# EAGLE design driver (EAGLE 9.6.2)
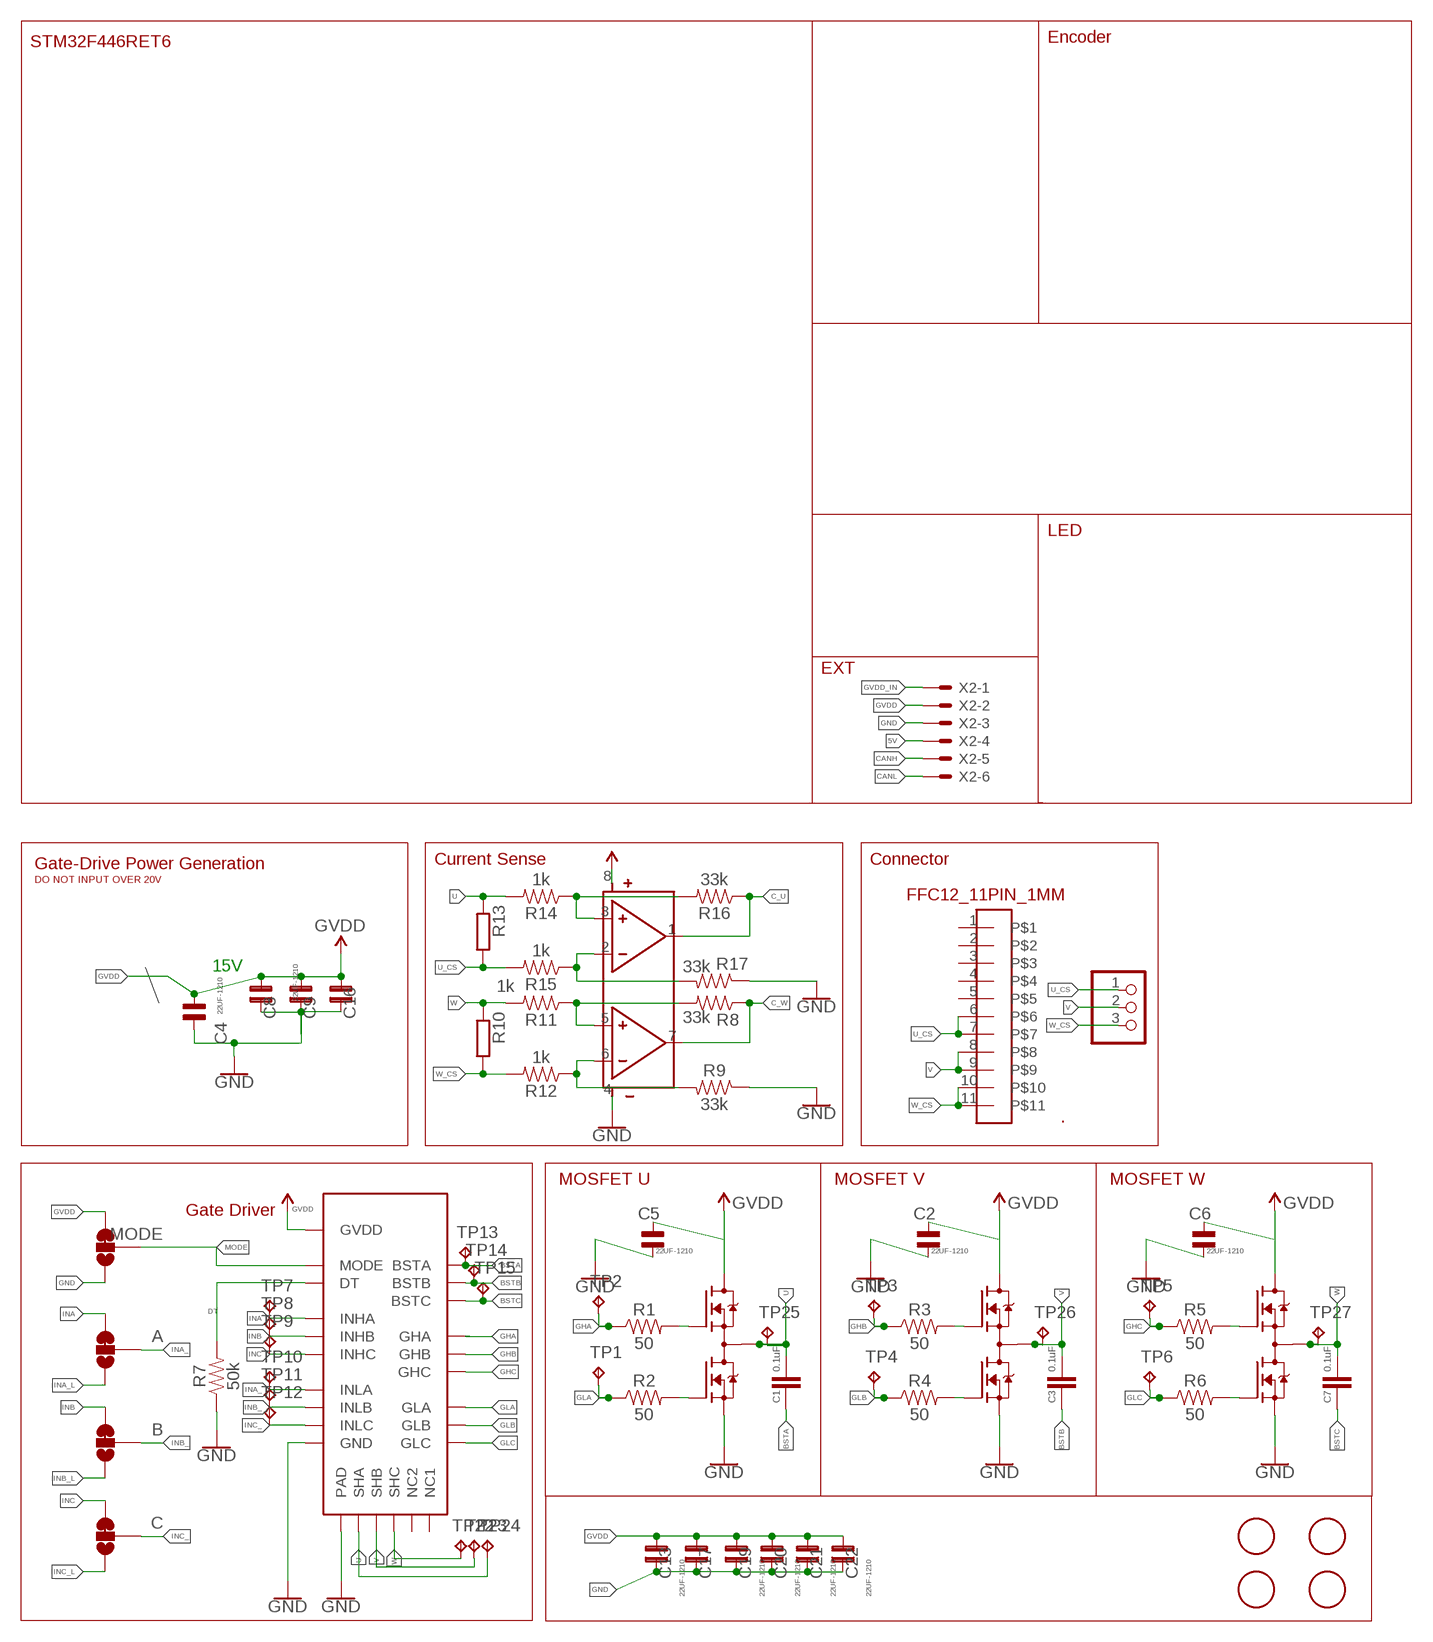
[diagram p0: schematic, sheet 1]

## Parts
.  FFC12_11PIN_1MM  [CON-SMT-FFCFPC_52207-1185]
A  JUMPER-SMT_3_1-NC_TRACE_SILK  [SMT-JUMPER_3_1-NC_TRACE_SILK]
B  JUMPER-SMT_3_1-NC_TRACE_SILK  [SMT-JUMPER_3_1-NC_TRACE_SILK]
C  JUMPER-SMT_3_1-NC_TRACE_SILK  [SMT-JUMPER_3_1-NC_TRACE_SILK]
C1  0.1uF  0.1UF-0603-25V-5%  [0603]
C2  22UF-1210  C0805  [0805]
C3  0.1uF  0.1UF-0603-25V-5%  [0603]
C4  0.1uF  C0805  [0805]
C5  22UF-1210  C0805  [0805]
C6  22UF-1210  C0805  [0805]
C7  0.1uF  0.1UF-0603-25V-5%  [0603]
C8  22UF-1210  C0805  [0805]
C9  22UF-1210  C0805  [0805]
C13  22UF-1210  C0805  [0805]
C16  22UF-1210  C0805  [0805]
C17  22UF-1210  C0805  [0805]
C19  22UF-1210  C0805  [0805]
C20  22UF-1210  C0805  [0805]
C21  22UF-1210  C0805  [0805]
C22  22UF-1210  C0805  [0805]
JP3  PINHD-1X3CB  [1X03-CLEANBIG]
MODE  JUMPER-SMT_3_1-NC_TRACE_SILK  [SMT-JUMPER_3_1-NC_TRACE_SILK]
Q2  SIZ240DT-T1-GE3  [TRANS_SIZ240DT-T1-GE3]
Q3  SIZ240DT-T1-GE3  [TRANS_SIZ240DT-T1-GE3]
Q4  SIZ240DT-T1-GE3  [TRANS_SIZ240DT-T1-GE3]
R1  50  1KOHM-0603-1/10W-1%  [0603]
R2  50  1KOHM-0603-1/10W-1%  [0603]
R3  50  1KOHM-0603-1/10W-1%  [0603]
R4  50  1KOHM-0603-1/10W-1%  [0603]
R5  50  1KOHM-0603-1/10W-1%  [0603]
R6  50  1KOHM-0603-1/10W-1%  [0603]
R7  50k  1KOHM-0603-1/10W-1%  [0603]
R8  33k  1KOHM-0603-1/10W-1%  [0603]
R9  33k  1KOHM-0603-1/10W-1%  [0603]
R10  SMS-REF  [SMS-REF]
R11  1k  1KOHM-0603-1/10W-1%  [0603]
R12  1k  1KOHM-0603-1/10W-1%  [0603]
R13  SMS-REF  [SMS-REF]
R14  1k  1KOHM-0603-1/10W-1%  [0603]
R15  1k  1KOHM-0603-1/10W-1%  [0603]
R16  33k  1KOHM-0603-1/10W-1%  [0603]
R17  33k  1KOHM-0603-1/10W-1%  [0603]
TP1  TPPAD1-13  [P1-13]
TP2  TPPAD1-13  [P1-13]
TP3  TPPAD1-13  [P1-13]
TP4  TPPAD1-13  [P1-13]
TP5  TPPAD1-13  [P1-13]
TP6  TPPAD1-13  [P1-13]
TP7  TPPAD1-13  [P1-13]
TP8  TPPAD1-13  [P1-13]
TP9  TPPAD1-13  [P1-13]
TP10  TPPAD1-13  [P1-13]
TP11  TPPAD1-13  [P1-13]
TP12  TPPAD1-13  [P1-13]
TP13  TPPAD1-13  [P1-13]
TP14  TPPAD1-13  [P1-13]
TP15  TPPAD1-13  [P1-13]
TP22  TPPAD1-13  [P1-13]
TP23  TPPAD1-13  [P1-13]
TP24  TPPAD1-13  [P1-13]
TP25  TPPAD1-13  [P1-13]
TP26  TPPAD1-13  [P1-13]
TP27  TPPAD1-13  [P1-13]
U1  QFN50P400X400X100-25NDRV8300DRGER  [QFN50P400X400X100-25N]
U4  SOP80P620X125-8N  [SOP80P620X125-8N]
U$1  PIN  [3MM]
U$3  PIN  [3MM]
U$4  PIN  [3MM]
U$5  PIN  [3MM]
X2  JST-XH-06-PIN-LONG-PAD  [JST-XH-06-PACKAGE-LONG-PAD]

## Nets
3V3: U4.8(VDD) ; supply symbol labelled GVDD
5V: X2.4
BSTA: C1.1 TP13.TP U1.BSTA
BSTB: C3.1 TP14.TP U1.BSTB
BSTC: C7.1 TP15.TP U1.BSTC
C_U: R16.1 U4.1(O1)
C_W: R8.1 U4.7(O2)
CANH: X2.5
CANL: X2.6
DT: R7.2 U1.DT
GHA: R1.1 TP2.TP U1.GHA
GHB: R3.1 TP3.TP U1.GHB
GHC: R5.1 TP5.TP U1.GHC
GLA: R2.1 TP1.TP U1.GLA
GLB: R4.1 TP4.TP U1.GLB
GLC: R6.1 TP6.TP U1.GLC
GND: C2.1 C4.2 C5.1 C6.1 C8.1 C9.1 C13.1 C16.1 C17.1 C19.1 C20.1 C21.1 C22.1 MODE.1 Q2.5(S2) Q2.6(S2) Q2.7(S2) Q3.5(S2) Q3.6(S2) Q3.7(S2) Q4.5(S2) Q4.6(S2) Q4.7(S2) R7.1 R9.1 R17.1 U1.GND U1.PAD U4.4(GND) X2.3
GVDD: C2.2 C4.1 C5.2 C6.2 C8.2 C9.2 C13.2 C16.2 C17.2 C19.2 C20.2 C21.2 C22.2 MODE.3 Q2.2(D1) Q2.3(D1) Q2.4(D1) Q2.10(D1) Q3.2(D1) Q3.3(D1) Q3.4(D1) Q3.10(D1) Q4.2(D1) Q4.3(D1) Q4.4(D1) Q4.10(D1) U1.GVDD X2.2 ; supply symbol labelled PVDD
GVDD_IN: X2.1
HA: Q2.1(G1) R1.2
HB: Q3.1(G1) R3.2
HC: Q4.1(G1) R5.2
INA: A.3 TP7.TP U1.INHA
INA_: A.2 TP10.TP U1.INLA
INA_L: A.1
INB: B.3 TP8.TP U1.INHB
INB_: B.2 TP11.TP U1.INLB
INB_L: B.1
INC: C.3 TP9.TP U1.INHC
INC_: C.2 TP12.TP U1.INLC
INC_L: C.1
LA: Q2.8(G2) R2.2
LB: Q3.8(G2) R4.2
LC: Q4.8(G2) R6.2
MODE: MODE.2 U1.MODE
N$8: R8.2 R11.1 U4.5(P2)
N$9: R9.2 R12.1 U4.6(M2)
N$10: R14.1 R16.2 U4.3(P1)
N$11: R15.1 R17.2 U4.2(M1)
U: C1.2 Q2.9(S1/D2) R13.2 R14.2 TP24.TP TP25.TP U1.SHA
U_CS: ..6 ..7 JP3.1 R13.1 R15.2
V: ..8 ..9 C3.2 JP3.2 Q3.9(S1/D2) TP23.TP TP26.TP U1.SHB
W: C7.2 Q4.9(S1/D2) R10.2 R11.2 TP22.TP TP27.TP U1.SHC
W_CS: ..10 ..11 JP3.3 R10.1 R12.2
Unconnected: ..1 ..2 ..3 ..4 ..5 U1.NC1 U1.NC2 U$1.P$1 U$3.P$1 U$4.P$1 U$5.P$1

## Notes on the sheet
- STM32F446RET6 | Encoder
- LED
- Recommended
- EXT
- Gate-Drive Power Generation | Current Sense | Connector
- DO NOT INPUT OVER 20V
- 15V
- MOSFET U | MOSFET V | MOSFET W
- Gate Driver

## Library data of the parts
. = MotorDriver_FourthEdition_prot:FFC12_11PIN_1MM
A B C MODE = SparkFun-Jumpers:JUMPER-SMT_3_1-NC_TRACE: Normally closed trace jumper (1 of 2 connections) This jumper has a trace between two pads so it's normally closed (NC). The other connection is normally open (NO). Use a razor knife to open the connection. For best results follow the IPC guidelines for cutting traces: Cutout at least 0.063 mm (0.005 in). Remove all loose material to clean up the cut area. Seal the cut with an approved epoxy. Reapply solder to reclose the connection, or to close the NO connection.
C1 C3 C7 = SparkFun-Capacitors:0.1UF: 0.1µF ceramic capacitors A capacitor is a passive two-terminal electrical component used to store electrical energy temporarily in an electric field.; PROD_ID: CAP-08604
C2 C4-C6 C8 C9 C13 C16 C17 C19-C22 = capsmd:C0805
JP3 = adafruit:PINHD-1X3: PIN HEADER
Q2-Q4 = SIZ240DT-T1-GE3:SIZ240DT-T1-GE3: Check availability <https://pricing.snapeda.com/parts/SIZ240DT-T1-GE3/Vishay%20Siliconix/view-part?ref=eda>; AVAILABILITY: In Stock; DESCRIPTION: Mosfet Array 2 N-Channel (Dual) 40V 17.2A (Ta), 48A (Tc), 16.9A (Ta), 47A (Tc) 4.3W (Ta), 33W (Tc) Surface Mount 8-PowerPair® (3.3x3.3); MF: Vishay Siliconix; MP: SIZ240DT-T1-GE3; PACKAGE: PowerWDFN-8 Vishay Siliconix; PRICE: None; PURCHASE-URL: https://pricing.snapeda.com/search/part/SIZ240DT-T1-GE3/?ref=eda
R1-R9 R16 R17 = SparkFun-Resistors:1KOHM: 1kΩ resistor A resistor is a passive two-terminal electrical component that implements electrical resistance as a circuit element. Resistors act to reduce current flow, and, at the same time, act to lower voltage levels within circuits. - Wikipedia; PROD_ID: RES-07856; VALUE: 1k
R10 R13 = resistor-shunt:SMS-REF: SMD SHUNT RESISTOR; OC_FARNELL: unknown; OC_NEWARK: unknown
R11 R12 R14 R15 = SparkFun-Resistors:1KOHM: 1kΩ resistor A resistor is a passive two-terminal electrical component that implements electrical resistance as a circuit element. Resistors act to reduce current flow, and, at the same time, act to lower voltage levels within circuits. - Wikipedia; PROD_ID: RES-07856
TP1-TP15 TP22-TP27 = testpad:TP: Test pad
U1 = DRV8300DRGER:QFN50P400X400X100-25N: DRV8300
U4 = NJM2732:SOP80P620X125-8N; A1_MIN: 0.0; A_MAX: 1.25; A_MIN: 1.25; A_NOM: 1.25; B_MAX: 0.35; B_MIN: 0.35; B_NOM: 0.35; D2_MAX: 0.0; D_MAX: 3.5; D_MIN: 3.5; D_NOM: 3.5; E1_MAX: 4.2; E1_MIN: 4.2; E1_NOM: 4.2; E2_MAX: 0.0; ENOM: 0.8; E_MAX: 6.2; E_MIN: 6.2; E_NOM: 6.2; L_MAX: 0.5; L_MIN: 0.5; L_NOM: 0.5; MANUFACTURER: New Japan Radio; PIN_COUNT: 8.0; SNAPEDA_PACKAGE_ID: 11524; STANDARD: IPC 7351B
U$1 U$3-U$5 = pin:PIN
X2 = Rembrandt Electronics - JST XH Connectors v1-0:JST-XH-06-PIN: JST XH Connector 2 Pin Wire to board connector. Pitch: 2,54 mm, (0.100") Number of pins: 6 Created by Rembrandt Electronics www.rembrandtelectronics.com

## Net classes
0 default: width 0.3 mm

## Board
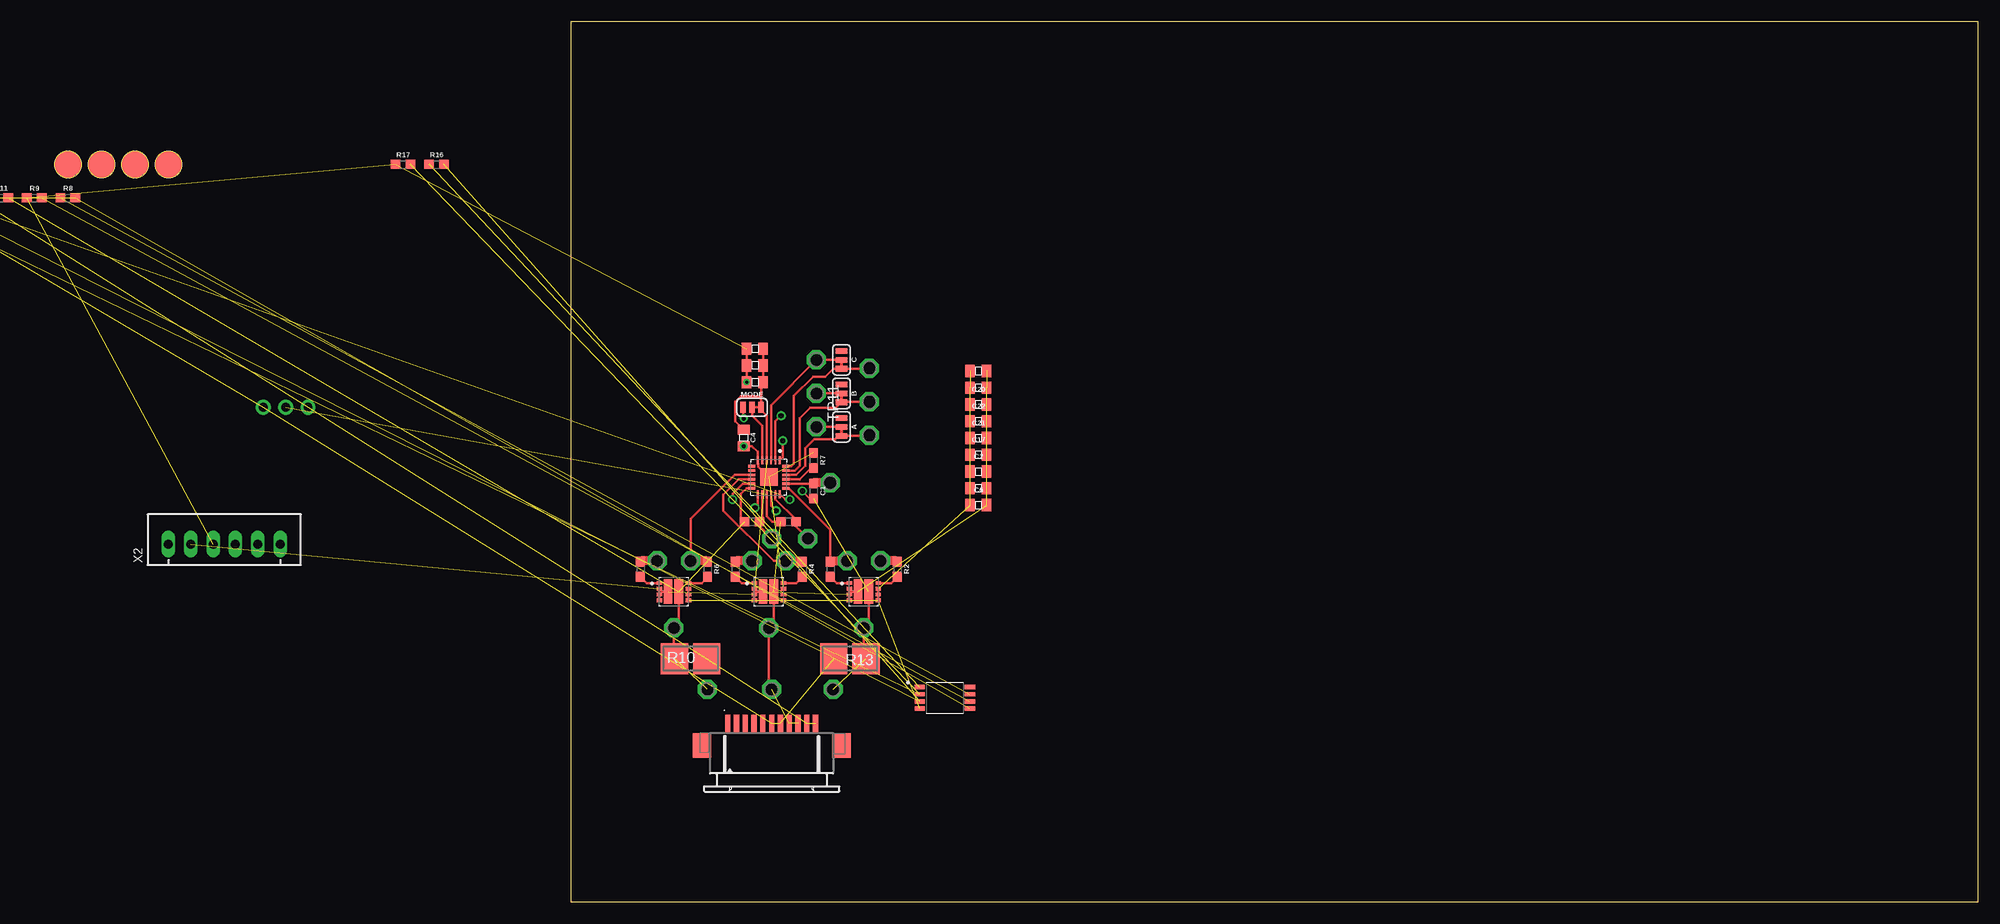
[diagram p1: board, top side]
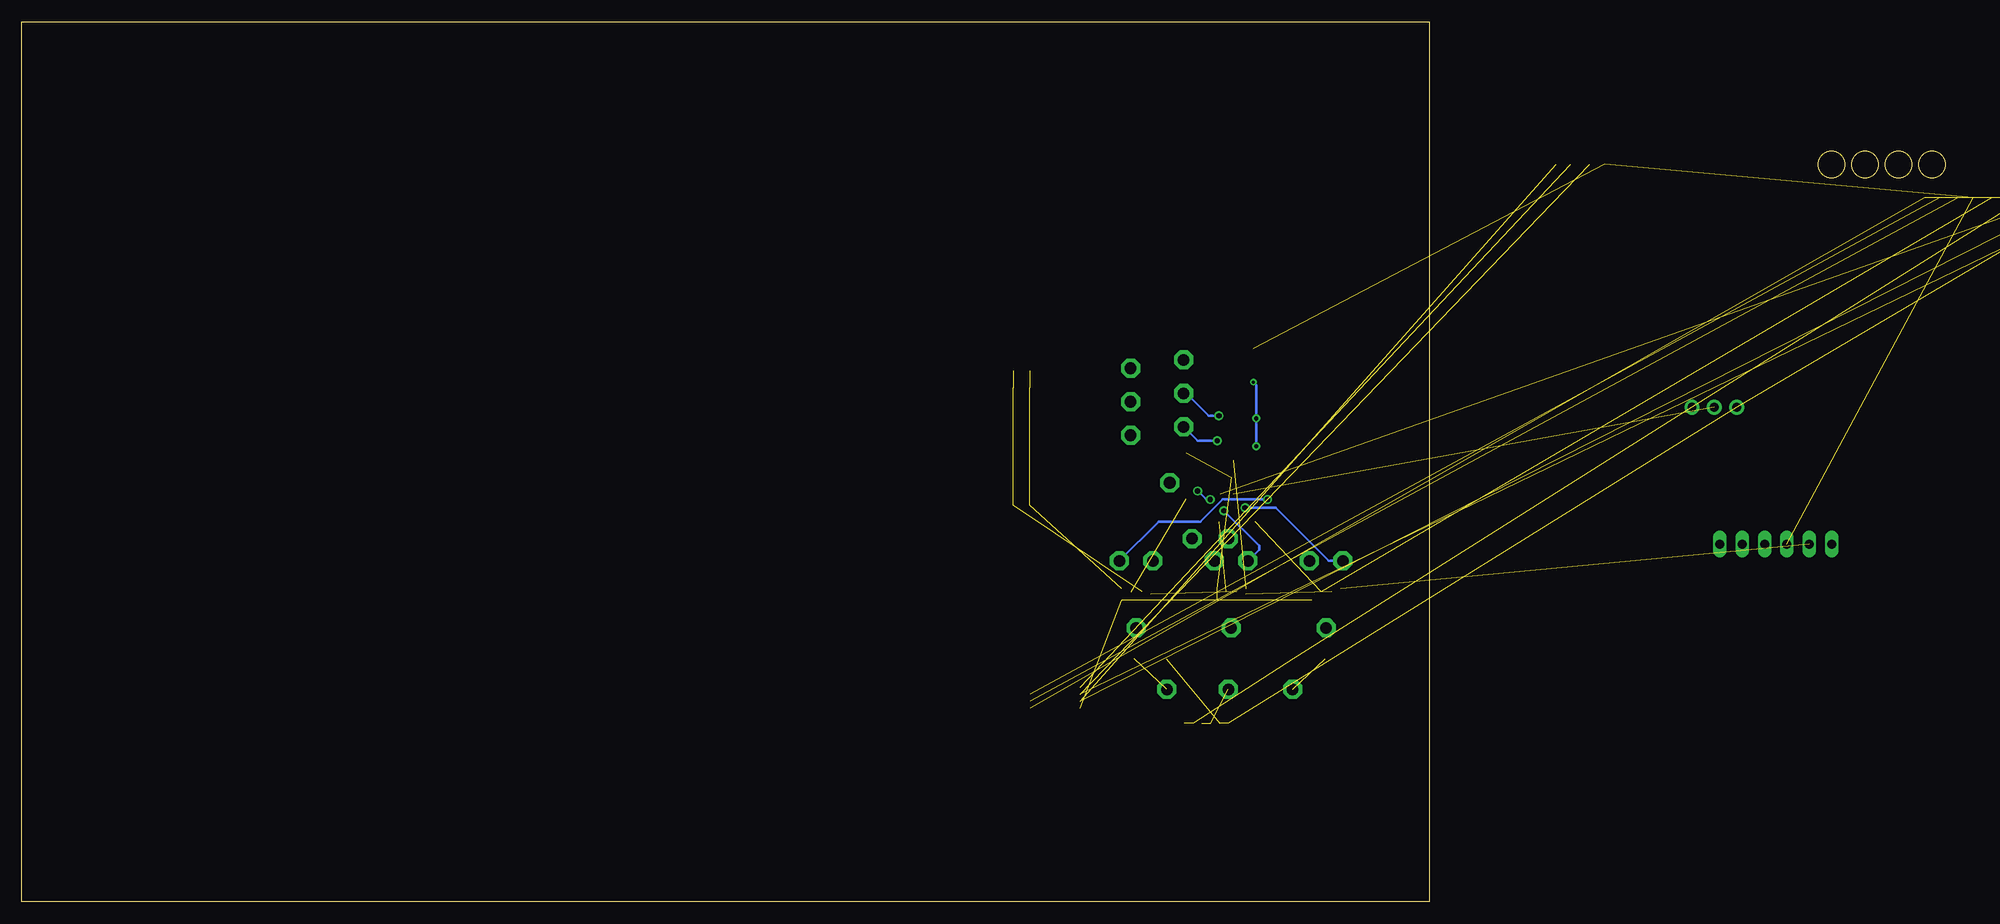
[diagram p2: board, bottom side, seen from below]

Size 160 x 100 mm. Coordinates in mm from the lower left corner, seen from the top.
Outline: 0,0 160,0 160,100 0,100 0,0
Copper layers (1*16): Top 0.035mm / dielectric 1.5mm / Bottom 0.035mm
Design rules "default": minimum track width 6mil, minimum drill 0.35mm, track to track 6mil, track to pad 6mil, pad to pad 6mil, via to via 6mil, smd to smd 6mil, copper to edge 40mil, drill to drill 6mil, minimum pad ring 10mil, minimum via ring 8mil, stop-mask expansion 4mil, vias tented up to drill 0mil, thermal gap 10mil

### Footprints (pad centres in the part's own frame; a part is rotated, then mirrored left to right if it is on the bottom)
CON-SMT-FFCFPC_52207-1185 = smd 0.6 x 1.9: 1 -5,2.5; 2 -4,2.5; 3 -3,2.5; 4 -2,2.5; 5 -1,2.5; 6 0,2.5; 7 1,2.5; 8 2,2.5; 9 3,2.5; 10 4,2.5; 11 5,2.5 | smd 2.1 x 2.8: P$1 -7.93,-0.03; P$4 7.945,-0.03
SMT-JUMPER_3_1-NC_TRACE_SILK = smd 0.635 x 1.27: 1 -1.016,0; 2 0,0; 3 1.016,0
0603 = smd 1.1 x 1: 1 -0.85,0; 2 0.85,0
0805 = smd 1.092 x 1.397: 1 -0.94,0; 2 0.94,0
1X03-CLEANBIG = drill 1.016 pad 1.676: 1 -2.54,0; 2 0,0; 3 2.54,0
TRANS_SIZ240DT-T1-GE3 = smd 0.62 x 0.44: 1 -1.64,0.975; 2 -1.64,0.325; 3 -1.64,-0.325; 4 -1.64,-0.975; 5 1.64,-0.975; 6 1.64,-0.325; 7 1.64,0.325; 8 1.64,0.975 | smd 1.005 x 2.8: 9 0.557,0 | smd 0.935 x 2.8: 10 -0.662,0
SMS-REF = smd 3.1 x 3.5: 1 1.829,0; 2 -1.829,0
P1-13 = drill 1.321 pad 2.159 octagon: TP 0,0
QFN50P400X400X100-25N = smd 0.27 x 0.86: BSTA 0.75,1.935; DT 0.25,1.935; GHA 1.25,1.935; GLA 0.75,-1.935; GLB 0.25,-1.935; GLC -0.25,-1.935; INHA -0.25,1.935; INHB -0.75,1.935; INHC -1.25,1.935; NC1 -1.25,-1.935; NC2 -0.75,-1.935; SHC 1.25,-1.935 | smd 0.86 x 0.27: BSTB 1.935,0.75; BSTC 1.935,-0.75; GHB 1.935,0.25; GHC 1.935,-1.25; GND -1.935,-1.25; GVDD -1.935,-0.25; INLA -1.935,1.25; INLB -1.935,0.75; INLC -1.935,0.25; MODE -1.935,-0.75; SHA 1.935,1.25; SHB 1.935,-0.25 | smd 2 x 2: PAD 0,0
SOP80P620X125-8N = smd 1.31 x 0.52: 1 -2.85,1.2; 2 -2.85,0.4; 3 -2.85,-0.4; 4 -2.85,-1.2; 5 2.85,-1.2; 6 2.85,-0.4; 7 2.85,0.4; 8 2.85,1.2
3MM = smd 3 x 3: P$1 0,0
JST-XH-06-PACKAGE-LONG-PAD = drill 1.016 long: 1 -6.35,0; 2 -3.81,0; 3 -1.27,0; 4 1.27,0; 5 3.81,0; 6 6.35,0

### Placement (x,y rotation side)
.  22.86,17.78 0 top
A  30.8,53.98 270 top
B  30.8,57.78 270 top
C  30.8,61.59 270 top
C1  27.62,46.67 270 top
C2  46.35,48.9 0 top
C3  24.77,43.18 180 top
C4  19.68,52.7 270 top
C5  46.35,46.99 0 top
C6  46.35,45.09 0 top
C7  20.64,43.18 180 top
C8  20.95,60.96 0 top
C9  20.95,59.05 0 top
C13  46.35,60.33 0 top
C16  20.95,62.87 0 top
C17  46.35,50.8 0 top
C19  46.35,58.42 0 top
C20  46.35,56.52 0 top
C21  46.35,52.7 0 top
C22  46.35,54.61 0 top
JP3  -32.38,56.2 0 top  (outside the outline)
MODE  20.64,56.2 0 top
Q2  33.34,35.24 0 top
Q3  22.54,35.24 0 top
Q4  11.75,35.24 0 top
R1  29.53,37.78 270 top
R2  37.15,37.78 270 top
R3  18.73,37.78 270 top
R4  26.35,37.78 270 top
R5  7.94,37.78 270 top
R6  15.56,37.78 270 top
R7  27.62,50.16 270 top
R8  -57.15,80.01 0 top  (outside the outline)
R9  -60.96,80.01 0 top  (outside the outline)
R10  13.65,27.62 0 top
R11  -64.77,80.01 0 top  (outside the outline)
R12  -68.58,80.01 0 top  (outside the outline)
R13  31.75,27.62 180 top
R14  -72.39,80.01 0 top  (outside the outline)
R15  -76.2,80.01 0 top  (outside the outline)
R16  -15.24,83.82 0 top  (outside the outline)
R17  -19.05,83.82 0 top  (outside the outline)
TP1  35.24,38.73 0 top
TP2  31.43,38.73 0 top
TP3  20.64,38.73 0 top
TP4  24.45,38.73 0 top
TP5  9.84,38.73 0 top
TP6  13.65,38.73 0 top
TP7  33.97,53.02 270 top
TP8  33.97,56.83 270 top
TP9  33.97,60.64 270 top
TP10  27.94,53.98 270 top
TP11  27.94,57.78 270 top
TP12  27.94,61.59 270 top
TP13  29.53,47.62 270 top
TP14  26.99,41.27 270 top
TP15  22.86,41.27 270 top
TP22  15.56,24.13 0 top
TP23  22.86,24.13 0 top
TP24  29.84,24.13 0 top
TP25  33.34,31.11 0 top
TP26  22.54,31.11 0 top
TP27  11.75,31.11 0 top
U1  22.54,48.26 270 top
U4  42.55,23.18 0 top
U$1  -45.72,83.82 0 top  (outside the outline)
U$3  -49.53,83.82 0 top  (outside the outline)
U$4  -53.34,83.82 0 top  (outside the outline)
U$5  -57.15,83.82 0 top  (outside the outline)
X2  -39.37,40.64 0 top  (outside the outline)

### Tracks (layer width: path | path; a pad name or v marks a point on that pad's centre or on a via)
BSTA
  Top 0.3: C1.1 U1.BSTA
  Top 1: C1.1 27.73,47.62 TP13.TP
BSTB
  Top 0.3: U1.BSTB 23.29,45.77 25.61,43.45 C3.1 25.61,42.65 TP14.TP
BSTC
  Top 0.3: U1.BSTC 21.79,43.48 C7.1 21.49,42.65 TP15.TP
C_U  (1 unrouted)
C_W  (1 unrouted)
DT
  Top 0.3: U1.DT 26.05,48.01 27.36,49.31 R7.2
GHA
  Top 0.3: U1.GHA 24.8,47.01 29.53,42.28 R1.1
  Top 1: R1.1 29.63,38.73 TP2.TP
GHB  (via drill 0.6)
  Top 0.3: U1.GHB 22.79,45.02 v23.37,44.45
  Top 1: TP3.TP 18.84,38.73 R3.1
  Bottom 0.3: v23.37,44.45 19.37,40.45 19.37,40.01 TP3.TP
GHC  (via drill 0.6)
  Top 0.3: U1.GHC 21.29,44.79 21.27,44.77 v20.95,44.77
  Top 1: TP5.TP 8.04,38.73 R5.1
  Bottom 0.3: TP5.TP 11.43,38.73 17.46,44.77 v20.95,44.77
GLA  (via drill 0.6)
  Top 0.3: U1.GLA 19.57,47.51 18.41,46.35 v18.41,45.72
  Top 1: R2.1 37.05,38.73 TP1.TP
  Bottom 0.3: v18.41,45.72 23.5,45.72 26.04,43.18 30.8,43.18 TP1.TP
GLB
  Top 0.3: U1.GLB 19.11,48.01 17.34,46.24 17.34,44.47 23.07,38.73 TP4.TP
  Top 1: TP4.TP 26.25,38.73 R4.1
GLC
  Top 0.3: TP6.TP 13.65,43.5 18.66,48.51 U1.GLC
  Top 1: TP6.TP 15.46,38.73 R6.1
GND  (via drill 0.35, 0.5)  (19 unrouted)
  Top 0.3: U1.PAD 21.34,49.46 21.34,49.75 21.29,49.8 U1.GND 21.27,50.22 21.27,51.12 20.62,51.77 C4.2 | MODE.1 19.62,54.99 v19.68,54.93 | C16.1 C8.1 C9.1 | Q4.5 Q4.6 Q4.7 | Q2.7 Q2.6 Q2.5
  Bottom 0.3: C4.2 v19.68,54.93 19.68,58.73 C9.1
  other vias: 19.68,51.77 20.02,59.05
GVDD  (13 unrouted)
  Top 0.3: MODE.3 21.65,55.88 22.29,55.24 U1.GVDD | C4.1 18.73,54.6 18.73,56.83 19.37,57.47 21.27,57.47 21.65,57.09 MODE.3 | MODE.3 21.65,58.81 C9.2 C8.2 C16.2 | Q4.4 Q4.3 Q4.2 10.43,35.24 Q4.10 | Q3.2 20.9,35.24 | 20.9,35.24 Q3.3 Q3.4 | Q3.10 20.9,35.24 | Q2.2 31.7,35.24 | 31.7,35.24 Q2.3 Q2.4 | Q2.10 31.7,35.24
HA
  Top 0.3: Q2.1 30.24,36.22 R1.2
HB
  Top 0.3: R3.2 19.45,36.22 Q3.1
HC
  Top 0.3: R5.2 8.65,36.22 Q4.1
INA
  Top 0.3: U1.INHA 25.66,48.51 26.7,49.55 26.7,51.56 27.68,52.55 30.07,52.55 30.48,52.96 A.3 33.91,52.96 TP7.TP
INA_  (via drill 0.6)
  Top 0.3: A.2 TP10.TP | U1.INLA 24.13,50.53 v24.13,52.39
  Bottom 0.3: TP10.TP 26.35,52.39 v24.13,52.39
INB
  Top 0.3: U1.INHB 25.52,49.01 26.04,49.53 26.04,54.93 27.24,56.13 30.16,56.13 B.3 31.05,56.77 31.11,56.83 TP8.TP
INB_  (via drill 0.6)
  Top 0.3: B.2 TP11.TP | U1.INLB 23.29,54.6 v23.93,55.24
  Bottom 0.3: TP11.TP 27.62,57.78 25.08,55.24 v23.93,55.24
INC
  Top 0.3: U1.INHC 25.11,49.51 25.4,49.8 25.4,57.52 27.57,59.69 28.96,59.69 29.84,60.58 C.3 33.91,60.58 TP9.TP
INC_
  Top 0.3: C.2 TP12.TP 22.79,56.45 U1.INLC
LA
  Top 0.3: R2.2 36.43,36.22 Q2.8
LB
  Top 0.3: Q3.8 25.64,36.22 R4.2
LC
  Top 0.3: Q4.8 14.89,36.22 15.56,36.88 R6.2
MODE
  Top 0.3: U1.MODE 21.79,54.09 20.64,55.24 MODE.2
N$8  (2 unrouted)
N$9  (2 unrouted)
N$10  (2 unrouted)
N$11  (2 unrouted)
U  (via drill 0.6)  (3 unrouted)
  Top 0.3: Q2.9 33.9,31.67 TP25.TP 33.34,27.86 R13.2 | C1.2 27.21,45.82 v26.35,46.68 | U1.SHA 24.4,45.72 v24.92,45.72
  Bottom 0.3: v26.35,46.68 25.39,45.72 v24.92,45.72
U_CS  (4 unrouted)
V  (4 unrouted)
  Top 0.3: TP23.TP 22.54,24.45 TP26.TP 23.1,31.67 Q3.9 | C3.2 22.93,43.18 22.29,43.82 U1.SHB
W  (3 unrouted)
  Top 0.3: U1.SHC 20.59,46.99 20,46.99 19.37,46.35 19.37,43.6 C7.2 | Q4.9 12.3,31.67 TP27.TP 11.75,27.7 R10.2
W_CS  (4 unrouted)